# Altium schematic sheet ITR9606Board.SchDoc
size A
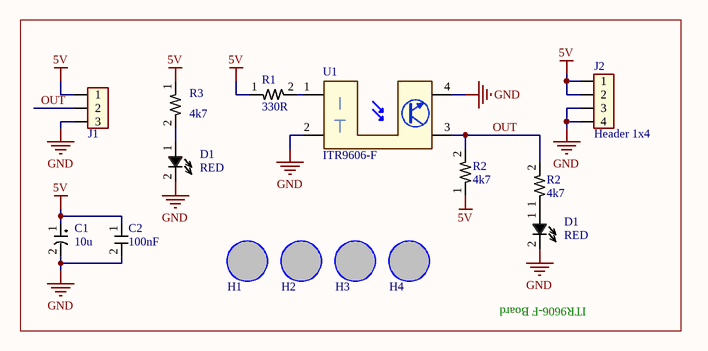
[diagram p0: ITR9606Board.SchDoc]

## Parts
(Parts that share a designator on the sheet are numbered #1, #2 ... from top to bottom, then left to right.)
C1  value 10u  [Tantalum Size A]  (hidden comment: Cap Pol)
C2  value 100nF  [C0805]  (hidden comment: Cap Non Pol)
D1#1  value RED  [D0805]  (hidden comment: LED)
D1#2  value RED  [D0805]  (hidden comment: LED)
H1  Drill 3mm  [Drill 3MM]  (value not drawn)
H2  Drill 3mm  [Drill 3MM]  (value not drawn)
H3  Drill 3mm  [Drill 3MM]  (value not drawn)
H4  Drill 3mm  [Drill 3MM]  (value not drawn)
J1  Header 1x3  [Header 1x3 Oval]  (value not drawn)
J2  Header 1x4  [Header 1x4 Oval]
R1  value 330R  [R0805]  (hidden comment: Resistor)
R2#1  value 4k7  [R0805]  (hidden comment: Resistor)
R2#2  value 4k7  [R0805]  (hidden comment: Resistor)
R3  value 4k7  [R0805]  (hidden comment: Resistor)
U1  ITR9606-F  [ITR9606-F]

## Blocks framed on the sheet
ITR9606-F Board: C1 C2 D1#1 D1#2 H1-H4 J1 J2 R1 R2#1 R2#2 R3 U1

## Nets
5V: C1.1 C2.1 J1.1 J2.1 J2.2 R1.1 R2#1.1 R3.1
GND: C1.2 C2.2 D1#1.2 D1#2.2 J1.3 J2.3 J2.4 U1.2(K) U1.4
OUT: J1.2 R2#1.2 R2#2.2 U1.3
NetD1#1_1: D1#1.1 R3.2
NetD1#2_1: D1#2.1 R2#2.1
NetR1_2: R1.2 U1.1(A)

Not connected (* = marked no-connect by the designer): H1 1; H2 1; H3 1; H4 1

## Library data of the parts
C1 = Cap Pol: Polarised Capacitor; Link: *
C2 = Cap Non Pol: Non Polarised Capacitor; Link: *
H1-H4 = Drill: Hole 3mm
J1 = Header 1x3: 2.54mm Single Male/Female Pin Header; Link: *
J2 = Header 1x4: 2.54mm Single Male/Female Pin Header; Link: *
U1 = ITR9606-F: Opto Interrupter, Sensing Distance 5mm; Link: *
D1#1 D1#2 = LED: Link: *
R1 R2#1 R2#2 R3 = Resistor: Link: *